# EAGLE schematic SensorBoard_01 (EAGLE 9.6.2)
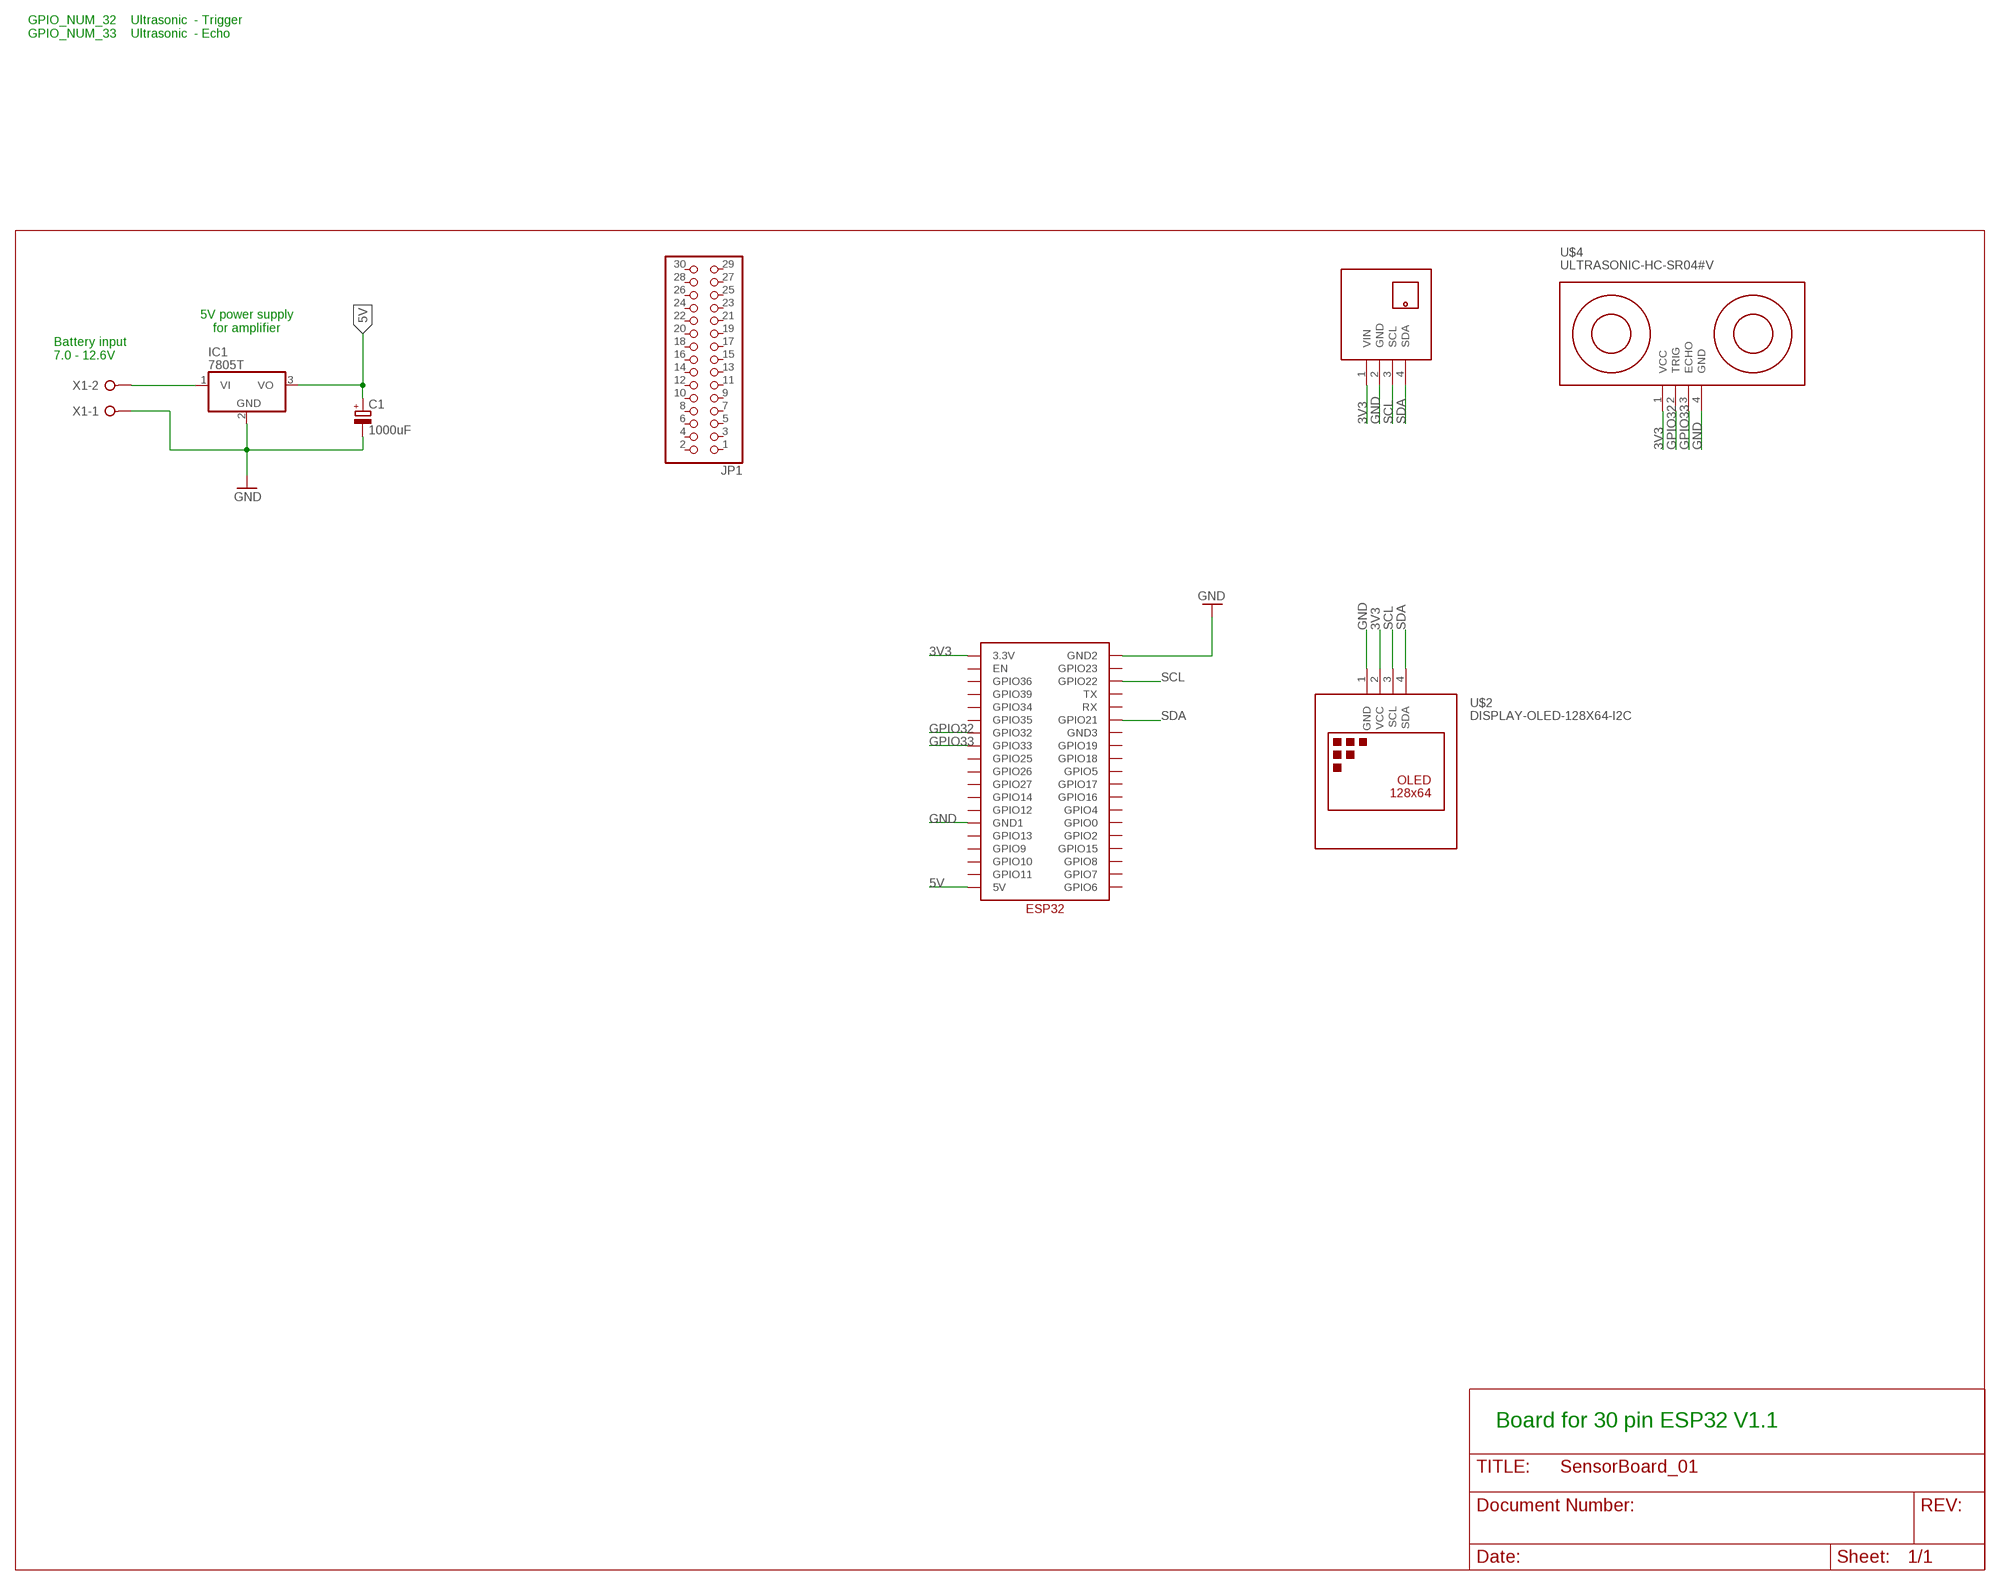
[diagram p0: schematic, sheet 1]

## Parts
C1  1000uF  CPOL-EUE5-10.5  [E5-10,5]
IC1  7805T  [TO220H]
JP1  PINHD-2X15  [2X15]
U$1  ESP32  [ESP32]
U$2  DISPLAY-OLED-128X64-I2C  [DISPLAY-OLED-128X64-I2C]
U$3  TEMP-HUM-PRES-BME280  [TEMP-HUM-PRES-BME280]
U$4  ULTRASONIC-HC-SR04#V  [ULTRASONIC-HC-SR04#V]
X1  W237-02P  [W237-132]

## Nets
3V3: U$1.3.3V U$2.2(VCC) U$3.1(VIN) U$4.1(VCC)
5V: C1.+ IC1.3(VO) U$1.5V
BAT+: IC1.1(VI) X1.2
GND: C1.- IC1.2(GND) U$1.GND1 U$1.GND2 U$2.1(GND) U$3.2(GND) U$4.4(GND) X1.1
GPIO32: U$1.GPIO32 U$4.2(TRIG)
GPIO33: U$1.GPIO33 U$4.3(ECHO)
SCL: U$1.GPIO22 U$2.3(SCL) U$3.3(SCL)
SDA: U$1.GPIO21 U$2.4(SDA) U$3.4(SDA)
Unconnected: JP1.1 JP1.2 JP1.3 JP1.4 JP1.5 JP1.6 JP1.7 JP1.8 JP1.9 JP1.10 JP1.11 JP1.12 JP1.13 JP1.14 JP1.15 JP1.16 JP1.17 JP1.18 JP1.19 JP1.20 JP1.21 JP1.22 JP1.23 JP1.24 JP1.25 JP1.26 JP1.27 JP1.28 JP1.29 JP1.30 U$1.EN U$1.GND3 U$1.GPIO0 U$1.GPIO2 U$1.GPIO4 U$1.GPIO5 U$1.GPIO6 U$1.GPIO7 U$1.GPIO8 U$1.GPIO9 U$1.GPIO10 U$1.GPIO11 U$1.GPIO12 U$1.GPIO13 U$1.GPIO14 U$1.GPIO15 U$1.GPIO16 U$1.GPIO17 U$1.GPIO18 U$1.GPIO19 U$1.GPIO23 U$1.GPIO25 U$1.GPIO26 U$1.GPIO27 U$1.GPIO34 U$1.GPIO35 U$1.GPIO36 U$1.GPIO39 U$1.RX U$1.TX

## Notes on the sheet
- GPIO_NUM_32    Ultrasonic  - Trigger
  GPIO_NUM_33    Ultrasonic  - Echo
- 5V power supply
  for amplifier
- Battery input
  7.0 - 12.6V
- Board for 30 pin ESP32 V1.1

## Library data of the parts
C1 = rcl:CPOL-EU: POLARIZED CAPACITOR, European symbol
IC1 = linear:78*: Positive VOLTAGE REGULATOR Source: http://cache.national.com/ds/LM/LM78L05.pdf http://www.fairchildsemi.com/ds/LM/LM7805.pdf
JP1 = pinhead:PINHD-2X15: PIN HEADER
U$1 = esp32a:ESP32
U$2 = diy-modules:DISPLAY-OLED-128X64-I2C: 128x64 Dot Matrix OLED Module based on SSD1306 chip Variant with I2C interface More details available here: http://www.instructables.com/id/Monochrome-096-i2c-OLED-display-with-arduino-SSD13/ SSD1306 datasheet: https://cdn-shop.adafruit.com/datasheets/SSD1306.pdf Click here to find device on ebay.com <http://www.ebay.com/sch/oled+display+128x64+iic> Note: There are two variants: I2C and SPI. Search for the proper version.
U$3 = diy-modules:TEMP-HUM-PRES-BME280: Digital Humidity-Temperature-Pressure Sensor based on BME280 device More information about BME280 device is available here: https://www.bosch-sensortec.com/bst/products/all_products/bme280 Click here to find device on ebay.com <http://www.ebay.com/sch/bme280+breakout>
U$4 = diy-modules:ULTRASONIC-HC-SR04: Ultrasonic Ranging Module HC-SR04 More details available here: http://randomnerdtutorials.com/complete-guide-for-ultrasonic-sensor-hc-sr04/ Click here to find device on ebay.com <http://www.ebay.com/sch/hc+sr04+ultrasonic>
X1 = con-wago-508:W237-02P: WAGO SREW CLAMP; OC_FARNELL: unknown; OC_NEWARK: unknown

## Net classes
0 5V: clearance 0.254 mm